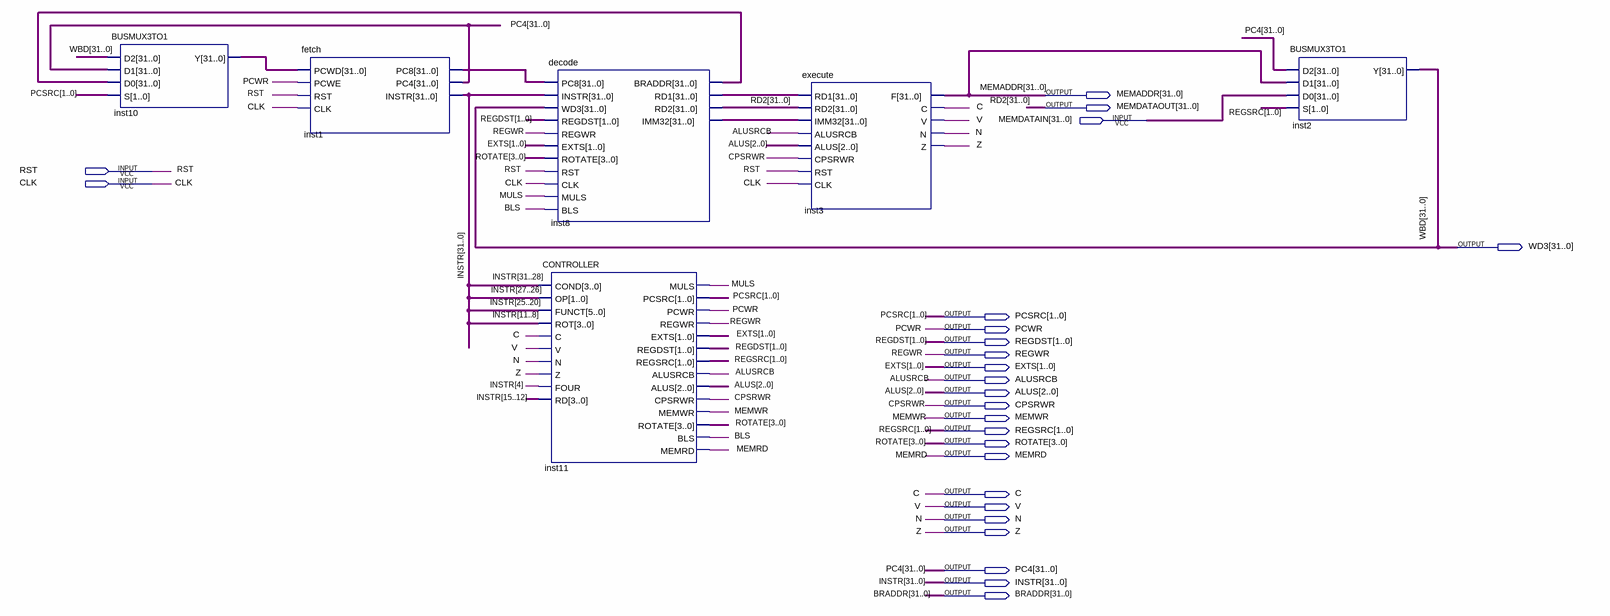
[diagram p0: schematic sheet]
// Quartus schematic scp.bdf as structural Verilog: 6 symbols, 25 pins
module scp (
  input  [31:0] MEMDATAIN,
  input  RST,
  input  CLK,
  output [31:0] MEMADDR,
  output [31:0] MEMDATAOUT,
  output [31:0] WD3,
  output [1:0] PCSRC,
  output PCWR,
  output [1:0] REGDST,
  output REGWR,
  output [1:0] EXTS,
  output ALUSRCB,
  output [2:0] ALUS,
  output CPSRWR,
  output MEMWR,
  output [1:0] REGSRC,
  output [3:0] ROTATE,
  output MEMRD,
  output C,
  output V,
  output N,
  output Z,
  output [31:0] PC4,
  output [31:0] INSTR,
  output [31:0] BRADDR
);

  wire BLS, MULS;
  wire [31:0] inst1_pc8, inst8_braddr, inst8_imm32, inst8_rd1, inst10_y;

  BUSMUX3TO1 inst10 (.D2(WD3), .D1(PC4), .D0(inst8_braddr), .S(PCSRC), .Y(inst10_y));
  fetch inst1 (.PCWD(inst10_y), .PCWE(PCWR), .RST(RST), .CLK(CLK), .PC8(inst1_pc8), .PC4(PC4), .INSTR(INSTR));
  decode inst8 (
    .PC8(inst1_pc8), .INSTR(INSTR), .WD3(WD3), .REGDST(REGDST), .REGWR(REGWR), .EXTS(EXTS), .ROTATE(ROTATE),
    .RST(RST), .CLK(CLK), .MULS(MULS), .BLS(BLS), .BRADDR(inst8_braddr), .RD1(inst8_rd1), .RD2(MEMDATAOUT),
    .IMM32(inst8_imm32));
  CONTROLLER inst11 (
    .COND(INSTR[31:28]), .OP(INSTR[27:26]), .FUNCT(INSTR[25:20]), .ROT(INSTR[11:8]), .C(C), .V(V), .N(N),
    .Z(Z), .FOUR(INSTR[4]), .RD(INSTR[15:12]), .MULS(MULS), .PCSRC(PCSRC), .PCWR(PCWR), .REGWR(REGWR),
    .EXTS(EXTS), .REGDST(REGDST), .REGSRC(REGSRC), .ALUSRCB(ALUSRCB), .ALUS(ALUS), .CPSRWR(CPSRWR),
    .MEMWR(MEMWR), .ROTATE(ROTATE), .BLS(BLS), .MEMRD(MEMRD));
  execute inst3 (
    .RD1(inst8_rd1), .RD2(MEMDATAOUT), .IMM32(inst8_imm32), .ALUSRCB(ALUSRCB), .ALUS(ALUS), .CPSRWR(CPSRWR),
    .RST(RST), .CLK(CLK), .F(MEMADDR), .C(C), .V(V), .N(N), .Z(Z));
  BUSMUX3TO1 inst2 (.D2(PC4), .D1(MEMADDR), .D0(MEMDATAIN), .S(REGSRC), .Y(WD3));

  // Other names for the same wires on the sheet: RD2[31:0] = MEMDATAOUT; WBD[31:0] = WD3
endmodule
